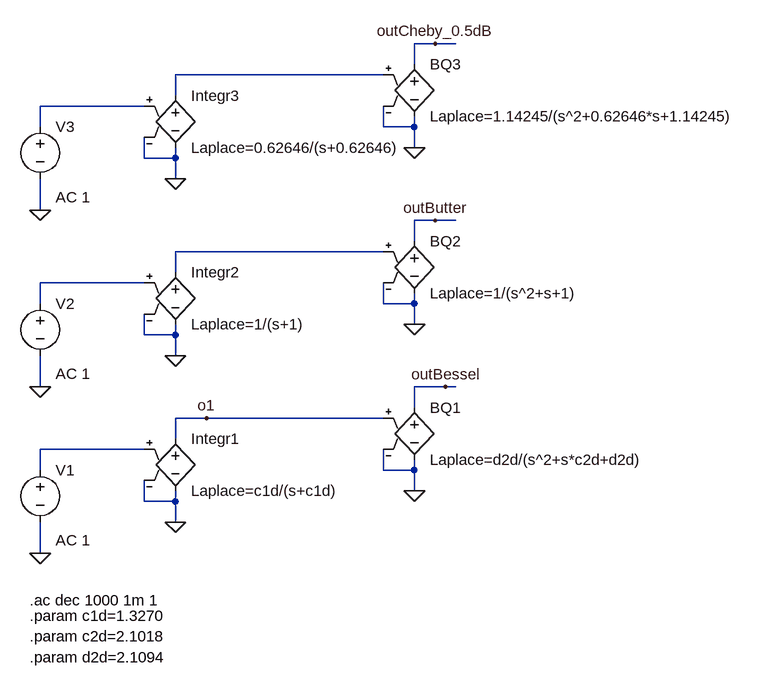
[diagram p0: schematic Laplace_fdt_3rd_order_normata.asc]
Laplace_fdt_3rd_order_normata.asc, the LTspice schematic file:
Version 4
SHEET 1 2564 1736
WIRE 1840 -160 1808 -160
WIRE 1872 -160 1840 -160
WIRE 1808 -128 1808 -160
WIRE 1760 -112 1440 -112
WIRE 1440 -80 1440 -112
WIRE 1392 -64 1232 -64
WIRE 1232 -32 1232 -64
WIRE 1760 -32 1760 -64
WIRE 1808 -32 1808 -48
WIRE 1808 -32 1760 -32
WIRE 1808 0 1808 -32
WIRE 1392 16 1392 -16
WIRE 1440 16 1440 0
WIRE 1440 16 1392 16
WIRE 1440 48 1440 16
WIRE 1232 96 1232 48
WIRE 1840 112 1808 112
WIRE 1872 112 1840 112
WIRE 1808 144 1808 112
WIRE 1760 160 1440 160
WIRE 1440 192 1440 160
WIRE 1392 208 1232 208
WIRE 1232 240 1232 208
WIRE 1760 240 1760 208
WIRE 1808 240 1808 224
WIRE 1808 240 1760 240
WIRE 1808 272 1808 240
WIRE 1392 288 1392 256
WIRE 1440 288 1440 272
WIRE 1440 288 1392 288
WIRE 1440 320 1440 288
WIRE 1232 368 1232 320
WIRE 1856 368 1808 368
WIRE 1872 368 1856 368
WIRE 1808 400 1808 368
WIRE 1488 416 1440 416
WIRE 1760 416 1488 416
WIRE 1440 448 1440 416
WIRE 1392 464 1232 464
WIRE 1232 496 1232 464
WIRE 1760 496 1760 464
WIRE 1808 496 1808 480
WIRE 1808 496 1760 496
WIRE 1808 528 1808 496
WIRE 1392 544 1392 512
WIRE 1440 544 1440 528
WIRE 1440 544 1392 544
WIRE 1440 576 1440 544
WIRE 1232 624 1232 576
FLAG 1232 624 0
FLAG 1440 576 0
FLAG 1488 416 o1
FLAG 1808 528 0
FLAG 1856 368 outBessel
FLAG 1232 368 0
FLAG 1440 320 0
FLAG 1808 272 0
FLAG 1840 112 outButter
FLAG 1232 96 0
FLAG 1440 48 0
FLAG 1808 0 0
FLAG 1840 -160 outCheby_0.5dB
SYMBOL voltage 1232 480 R0
WINDOW 123 24 124 Left 2
WINDOW 39 0 0 Left 0
SYMATTR Value2 AC 1
SYMATTR InstName V1
SYMATTR Value ""
SYMBOL e 1440 432 R0
SYMATTR InstName Integr1
SYMATTR Value Laplace=c1d/(s+c1d)
SYMBOL e 1808 384 R0
SYMATTR InstName BQ1
SYMATTR Value Laplace=d2d/(s^2+s*c2d+d2d)
SYMBOL voltage 1232 224 R0
WINDOW 123 24 124 Left 2
WINDOW 39 0 0 Left 0
SYMATTR Value2 AC 1
SYMATTR InstName V2
SYMATTR Value ""
SYMBOL e 1440 176 R0
SYMATTR InstName Integr2
SYMATTR Value Laplace=1/(s+1)
SYMBOL e 1808 128 R0
SYMATTR InstName BQ2
SYMATTR Value Laplace=1/(s^2+s+1)
SYMBOL voltage 1232 -48 R0
WINDOW 123 24 124 Left 2
WINDOW 39 0 0 Left 0
SYMATTR Value2 AC 1
SYMATTR InstName V3
SYMATTR Value ""
SYMBOL e 1440 -96 R0
SYMATTR InstName Integr3
SYMATTR Value Laplace=0.62646/(s+0.62646)
SYMBOL e 1808 -144 R0
SYMATTR InstName BQ3
SYMATTR Value Laplace=1.14245/(s^2+0.62646*s+1.14245)
TEXT 1216 696 Left 2 !.ac dec 1000 1m 1
TEXT 1216 720 Left 2 !.param c1d=1.3270
TEXT 1216 752 Left 2 !.param c2d=2.1018
TEXT 1216 784 Left 2 !.param d2d=2.1094

The netlist it stands for:
* Laplace_fdt_3rd_order_normata.asc
V1 N005 0 AC 1
E§Integr1 o1 0 N005 0 Laplace=c1d/(s+c1d)
E§BQ1 outBessel 0 o1 0 Laplace=d2d/(s^2+s*c2d+d2d)
V2 N004 0 AC 1
E§Integr2 N003 0 N004 0 Laplace=1/(s+1)
E§BQ2 outButter 0 N003 0 Laplace=1/(s^2+s+1)
V3 N002 0 AC 1
E§Integr3 N001 0 N002 0 Laplace=0.62646/(s+0.62646)
E§BQ3 outCheby_0.5dB 0 N001 0 Laplace=1.14245/(s^2+0.62646*s+1.14245)
.ac dec 1000 1m 1
.param c1d=1.3270
.param c2d=2.1018
.param d2d=2.1094
.backanno
.end